# EAGLE design GyroV1.0b (EAGLE 5.10)
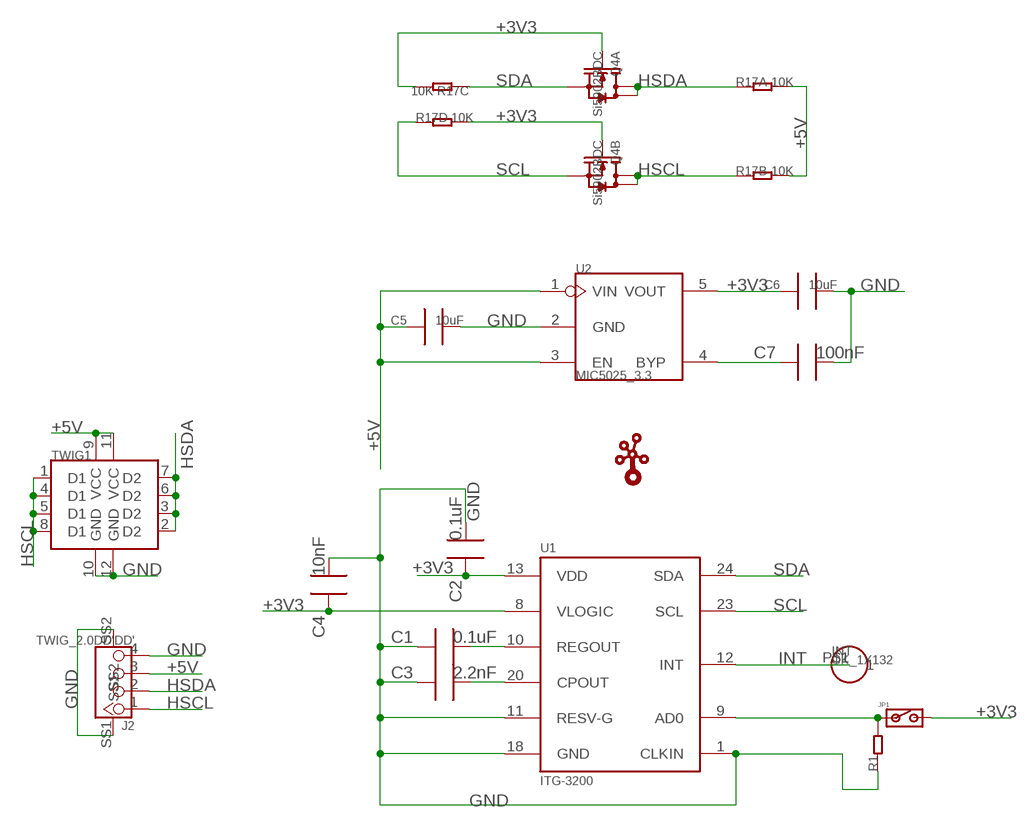
[diagram p0: schematic, sheet 1]

## Parts
C1  0.1uF  C0603_S  [0603_S]
C2  0.1uF  C0603_S  [0603_S]
C3  2.2nF  C0603_S  [0603_S]
C4  10nF  C0603_S  [0603_S]
C5  10uF  C0805_S  [0805_S]
C6  10uF  C0805_S  [0805_S]
C7  100nF  C0603_S  [0603_S]
INT  CK_1X132  [CK_1X1]
J2  TWIG_2.0DD'DD'  [2.0_1X4DD]
JP1  JP_SW  [JP_SW]
Q4  Si5902BDC  010-DUAL-N-MOSFET_1206-8  [1206-8]
R1  005-R0402  [0402]
R17  10K  005-4R_1206  [R1206-8]
TWIG1  TWIG-U1'HOLES'  [U1_HOLES]
U1  ITG-3200  [QFN-24]
U2  MIC5025_3.3  MIC5025_X.X  [SOT23-5]
U$1  TWIGLOGOTWIGLOGO_SMALL  [TWIGLOGO_SMALL]

## Nets
+3V3: C2.1 C4.1 C6.1 JP1.2 Q4.2(A:G) Q4.4(B:G) R17.5 R17.6 U1.8(VLOGIC) U1.13(VDD) U2.5(VOUT)
+5V: C5.1 J2.3 R17.7 R17.8 TWIG1.9(VCC) TWIG1.11(VCC) U2.1(VIN) U2.3(EN)
GND: C1.1 C2.2 C3.1 C4.2 C5.2 C6.2 C7.2 J2.4 J2.SS1 J2.SS2 R1.1 TWIG1.10(GND) TWIG1.12(GND) U1.1(CLKIN) U1.11(RESV-G) U1.18(GND) U2.2(GND)
HSCL: J2.1 Q4.5(B:D) Q4.6(B:D) R17.2 TWIG1.1(D1) TWIG1.4(D1) TWIG1.5(D1) TWIG1.8(D1)
HSDA: J2.2 Q4.7(A:D) Q4.8(A:D) R17.1 TWIG1.2(D2) TWIG1.3(D2) TWIG1.6(D2) TWIG1.7(D2)
INT: INT.P$1 U1.12(INT)
N$1: C3.2 U1.20(CPOUT)
N$2: JP1.1 R1.2 U1.9(AD0)
N$3: C1.2 U1.10(REGOUT)
N$4: C7.1 U2.4(BYP)
SCL: Q4.3(B:S) R17.4 U1.23(SCL)
SDA: Q4.1(A:S) R17.3 U1.24(SDA)

## Library data of the parts
C1-C4 C7 = CPT_SMD:C0603
C5 C6 = CPT_SMD:C0805
INT = CONNECTER1:CK_1X1
J2 = CONNECTER:TWIG_2.0DD
JP1 = CPT_SMD:JP_SW
Q4 = Discrete:010-DUAL-N-MOSFET*: Si5902BDC Si5904DC Si5908DC Si5920DC
R1 = Discrete:005-R*
R17 = Discrete:005-4R*: Resistor Array
TWIG1 = twig_template1:TWIG-U1
U1 = SparkFun:ITG-3200: ITG-3200 3-axis gyro, digital output, qfn24 package
U2 = ICs_v54:MIC5025_X.X
U$1 = seeedleo:TWIGLOGO

## Net classes
0 default: width 0.203 mm, drill 0.305 mm, clearance 0.203 mm

## Board
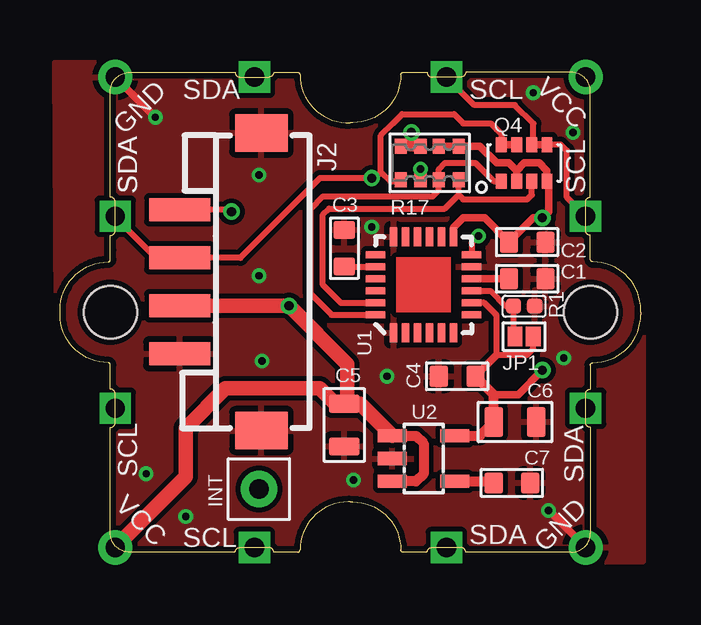
[diagram p1: board, top side]
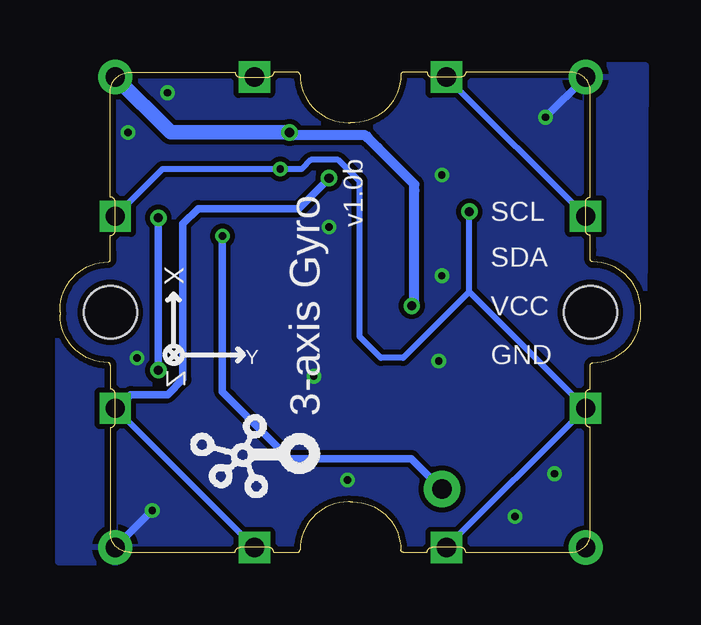
[diagram p2: board, bottom side, seen from below]

Size 24.2 x 20 mm. Coordinates in mm from the lower left corner, seen from the top.
Copper layers (1*16): Top 0.035mm / dielectric 1.5mm / Bottom 0.035mm
Design rules "SeeedStudio_rule_no_angle_090911": minimum track width 6mil, minimum drill 12mil, track to track 6mil, track to pad 6mil, pad to pad 6mil, via to via 6mil, smd to smd 0mil, copper to edge 10mil, drill to drill 10mil, minimum pad ring 10mil, minimum via ring 6mil, stop-mask expansion 2mil, vias tented up to drill 100mil, thermal gap 10mil

### Footprints (pad centres in the part's own frame; a part is rotated, then mirrored left to right if it is on the bottom)
0603_S = smd 0.762 x 0.889: 1 -0.762,0; 2 0.762,0
0805_S = smd 0.762 x 1.27: 1 -0.889,0; 2 0.889,0
CK_1X1 = drill 0.813 pad 1.524 round: P$1 0,0
2.0_1X4DD = smd 0.965 x 2.54: 1 -3,0; 2 -1,0; 3 1,0; 4 3,0 | smd 1.55 x 2.184: SS1 -6.2,3.4; SS2 6.2,3.4
JP_SW = smd 0.813 x 0.61: 1 0,0.381; 2 0,-0.381
1206-8 = smd 0.457 x 0.635: 1 -0.953,-0.762; 2 -0.318,-0.762; 3 0.318,-0.762; 4 0.953,-0.762; 5 0.953,0.762; 6 0.318,0.762; 7 -0.318,0.762; 8 -0.953,0.762
0402 = smd 0.635 x 0.635: 1 -0.445,0; 2 0.445,0
R1206-8 = smd 0.508 x 0.635: 1 -1.206,-0.699; 2 -0.381,-0.699; 3 0.381,-0.699; 4 1.206,-0.699; 5 1.206,0.699; 6 0.381,0.699; 7 -0.381,0.699; 8 -1.206,0.699
U1_HOLES = drill 0.8 pad 1.27 square: 1 -4,9.8; 2 4,9.8; 3 9.8,4; 4 9.8,-4; 5 4,-9.8; 6 -4,-9.8; 7 -9.8,-4; 8 -9.8,4 | drill 0.8 pad 1.422 round: 9 -9.8,9.8; 10 9.8,9.8; 11 9.8,-9.8; 12 -9.8,-9.8 | hole 2.2: 0,-10; 0,10
QFN-24 = smd 0.8 x 0.3: 1 -2,1.25; 2 -2,0.75; 3 -2,0.25; 4 -2,-0.25; 5 -2,-0.75; 6 -2,-1.25; 13 2,-1.25; 14 2,-0.75; 15 2,-0.25; 16 2,0.25; 17 2,0.75; 18 2,1.25 | smd 0.3 x 0.8: 7 -1.25,-2; 8 -0.75,-2; 9 -0.25,-2; 10 0.25,-2; 11 0.75,-2; 12 1.25,-2; 19 1.25,2; 20 0.75,2; 21 0.25,2; 22 -0.25,2; 23 -0.75,2; 24 -1.25,2
SOT23-5 = smd 0.55 x 1.2: 1 -0.95,-1.3; 2 0,-1.3; 3 0.95,-1.3; 4 0.95,1.3; 5 -0.95,1.3

### Placement (x,y rotation side)
C1  19.47,11.4 180 top
C2  19.47,12.92 0 top
C3  11.85,12.67 270 top
C4  16.55,7.33 180 top
C5  11.85,5.3 270 top
C6  18.96,5.43 0 top
C7  18.83,2.89 0 top
INT  8.29,2.63 90 top
J2  4.99,11.27 270 top
JP1  19.34,8.98 90 top
Q4  19.34,16.22 0 top
R1  19.34,10.25 180 top
R17  15.4,16.22 0 top
TWIG1  12.1,10 90 top
U1  15.15,11.14 90 top
U2  15.15,3.9 270 top
U$1  13.24,1.87 90 bottom

### Tracks (layer width: path | path; a pad name or v marks a point on that pad's centre or on a via)
+3V3  (via drill 0.38)
  Top 0.254: U1.8 17.68,10.39 18.13,9.94 | 18.2,9.87 18.13,9.94 | 18.2,9.87 18.2,8.22 18.32,8.22 19.47,8.22 19.72,8.48 JP1.2 | 18.2,9.87 18.13,9.94
  Top 0.305: 19.02,15.91 Q4.2 | 19.02,15.91 18.7,16.22 18.2,16.22 17.5,16.92 R17.5 R17.6 | 19.02,15.91 19.34,16.22 19.97,16.22 20.29,15.91 Q4.4 20.36,15.4 20.36,14.19 v20.1,13.94 19.72,13.94 C2.1 17.69,13.94 17.18,13.94 16.8,13.94 16.4,13.54 U1.13 | C4.1 18.2,8.22 | 18.07,6.57 19.09,6.57 v20.1,7.59
  Top 0.406: U2.5 17.49,4.85 C6.1 18.07,6.57 C4.1
  Bottom 0.305: v20.1,7.59 v20.1,13.94
+5V  (via drill 0.38)
  Top 0.406: C5.1 12.51,6.19 | U2.1 14.83,4.85 15.15,4.54 15.15,3.27 14.83,2.95 U2.3 | 14.58,16.92 14.64,16.98 v14.64,17.49 | v9.54,10.27 8.93,10.27 | 14.58,16.92 R17.8 14.58,16.92 | 14.58,16.92 R17.7
  Top 0.61: J2.3 8.93,10.27 v9.54,10.27 11.97,7.84 11.97,6.32 C5.1 11.47,6.19 10.83,6.83 6.89,6.83 5.24,5.17 5.24,3.14 TWIG1.9 | 12.51,6.19 U2.1
  Bottom 0.406: v9.54,10.27 9.43,10.38 9.43,15.08 9.43,15.33 10.96,16.86 11.21,17.11 11.34,17.24 11.47,17.37 14.51,17.37 v14.64,17.49
  Bottom 0.61: TWIG1.11 19.59,17.49 15.02,17.49 v14.64,17.49
GND  (via drill 0.3)
  Top 0.305: v3.97,18.13 TWIG1.10 | TWIG1.12 v20.36,1.75 TWIG1.12
  Bottom 0.305: 3.99,18.11 2.32,19.78 | TWIG1.12 v20.36,1.75
  other vias: 13.62,7.33 8.29,11.52 12.23,3.02 5.24,1.49 3.59,3.27 12.99,13.56 20.99,8.1 8.29,15.72 21.37,17.49 19.72,19.14 8.42,7.97
  pour Bottom (isolate 0.203, rank 6): -0.09,-0.54 -0.22,20.29 24.29,20.41 24.29,-0.41
  pour Top (isolate 0.203, rank 6): -0.09,-0.54 -0.22,20.41 24.29,20.41 24.29,-0.41
HSCL  (via drill 0.3, 0.38)
  Top 0.254: Q4.6 19.72,17.05 19.72,17.87 18.96,18.64 17.31,18.64 17.26,18.64 TWIG1.4 | Q4.5 20.86,16.98 21.12,16.73 21.12,14.78 TWIG1.5 | J2.1 7.07,14.27 v7.15,14.19 | v15.02,15.97 R17.2
  Top 0.305: Q4.5 Q4.6
  Bottom 0.254: 7.15,10.85 v7.15,14.19 | 7.15,10.85 TWIG1.1 2.41,5.89 | TWIG1.8 2.41,5.89 | 2.41,5.89 2.45,5.94 | TWIG1.5 19.93,15.97 v15.02,15.97 14.26,15.97 14.13,15.97 13.75,16.35 12.61,16.35 11.72,15.46 11.72,8.98 10.83,8.1 9.9,8.1 7.15,10.85
HSDA  (via drill 0.38)  (1 unrouted)
  Top 0.254: Q4.8 18.39,17.43 18.2,17.62 17.94,17.87 16.8,17.87 16.42,18.26 14.26,18.26 13.88,17.87 13.37,17.37 13.37,15.84 | 13.37,15.84 13.75,15.46 14.13,15.46 R17.1 | v12.99,15.59 10.83,15.59 7.51,12.27 J2.2 4.97,12.29 3.97,12.29 2.3,13.96 TWIG1.2 | v12.99,15.59 13.12,15.59 | 13.12,15.59 13.37,15.84 | v12.99,15.59 13.12,15.59 | 13.12,15.59 13.37,15.84
  Top 0.305: Q4.8 Q4.7
  Bottom 0.254: 8.06,19.8 8.06,19.76 TWIG1.2 | TWIG1.7 TWIG1.6 21.81,6
  Bottom 0.305: 21.81,6 21.24,6.57 19.72,6.57 19.09,7.21 19.09,13.68 18.45,14.32 14.26,14.32 v12.99,15.59
INT  (via drill 0.3)
  Top 0.254: U1.12 17.15,12.89 v17.43,13.18
  Bottom 0.305: INT.P$1 9.56,3.9 14.64,3.9 17.18,6.44 17.43,6.7 v17.43,13.18
N$1
  Top 0.254: C3.2 13.39,11.91 U1.20
N$2
  Top 0.254: U1.9 17.94,10.89 18.58,10.25 R1.2 18.9,9.05 JP1.1
N$3
  Top 0.305: U1.10 18.45,11.39 C1.2
N$4
  Top 0.406: U2.4 18,2.95 C7.1
SCL
  Top 0.254: 16.61,14.89 R17.4 | 16.61,14.89 16.8,14.7 19.09,14.7 19.47,14.7 19.66,14.89 Q4.3 | U1.23 11.71,10.39 10.96,11.14 10.96,14.06 11.21,14.32 16.04,14.32 16.61,14.89
SDA
  Top 0.254: Q4.1 18.07,15.46 17.37,16.16 | 17.31,16.22 17.37,16.16 | 17.31,16.22 16.04,16.22 15.78,15.97 R17.3 15.78,15.08 15.53,14.83 10.96,14.83 10.45,14.32 10.45,10.76 11.32,9.89 U1.24 | 17.31,16.22 17.37,16.16

### Text on the board
tPlace: GND | SDA | SCL | VCC | SDA | SDA | SCL | SDA | SCL | GND | VCC | SCL | SDA
bPlace: SCL | v1.0b | SDA | X | VCC | GND | Y | Z | 3-axis Gyro